# Altium schematic sheet Fliege_Notch.SchDoc
size A; SheetNumber: 5; SheetTotal: 6
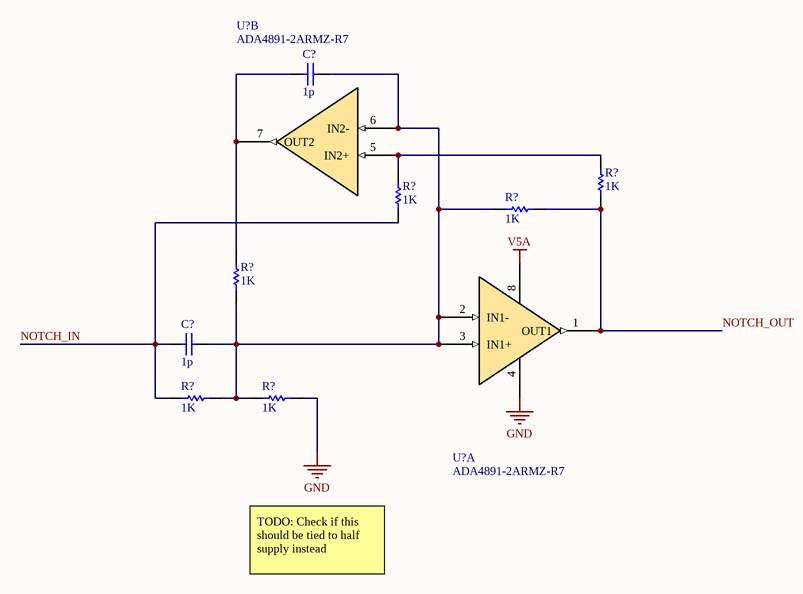
[diagram p0: Fliege_Notch.SchDoc]

## Parts
(Parts that share a designator on the sheet are numbered #1, #2 ... from top to bottom, then left to right.)
C?#1  value 1p  (hidden comment: Capacitor)
C?#2  value 1p  (hidden comment: Capacitor)
R?#1  value 1K  (hidden comment: Resistor)
R?#2  value 1K  (hidden comment: Resistor)
R?#3  value 1K  (hidden comment: Resistor)
R?#4  value 1K  (hidden comment: Resistor)
R?#5  value 1K  (hidden comment: Resistor)
R?#6  value 1K  (hidden comment: Resistor)
U?#1  ADA4891-2ARMZ-R7  (part B of 2)
U?#2  ADA4891-2ARMZ-R7  (part A of 2)

## Nets
GND: R?#6.2 U?#2.4(V-)
V5A: U?#2.8(V+)
NOTCH_IN: C?#2.1 R?#3.1 R?#5.1
NOTCH_OUT: R?#1.1 R?#2.1 U?#2.1(OUT1)
NetC?#1_1: C?#1.1 R?#4.2 U?#1.7(OUT2)
NetC?#1_2: C?#1.2 C?#2.2 R?#1.2 R?#4.1 R?#5.2 R?#6.1 U?#1.6(IN2-) U?#2.2(IN1-) U?#2.3(IN1+)
NetR?#2_2: R?#2.2 R?#3.2 U?#1.5(IN2+)

## Notes on the sheet
- TODO: Check if this should be tied to half supply instead

## Library data of the parts
C?#1 C?#2 = Capacitor: SimulationGenericComponent: True
R?#1-R?#6 = Resistor: TC1: 0; SimulationGenericComponent: True; TC2: 0
U?#1 U?#2 = ADA4891-2ARMZ-R7: CMOS Amplifier 2 Circuit Rail-to-Rail 8-MSOP